# Altium schematic sheet QUTMS-TSAL-S00.SchDoc: Tractive System Active Light - TSAL
size A3; DrawnBy: Joseph Richards; DocumentNumber: 1; Revision: 1; SheetNumber: 1; SheetTotal: 5
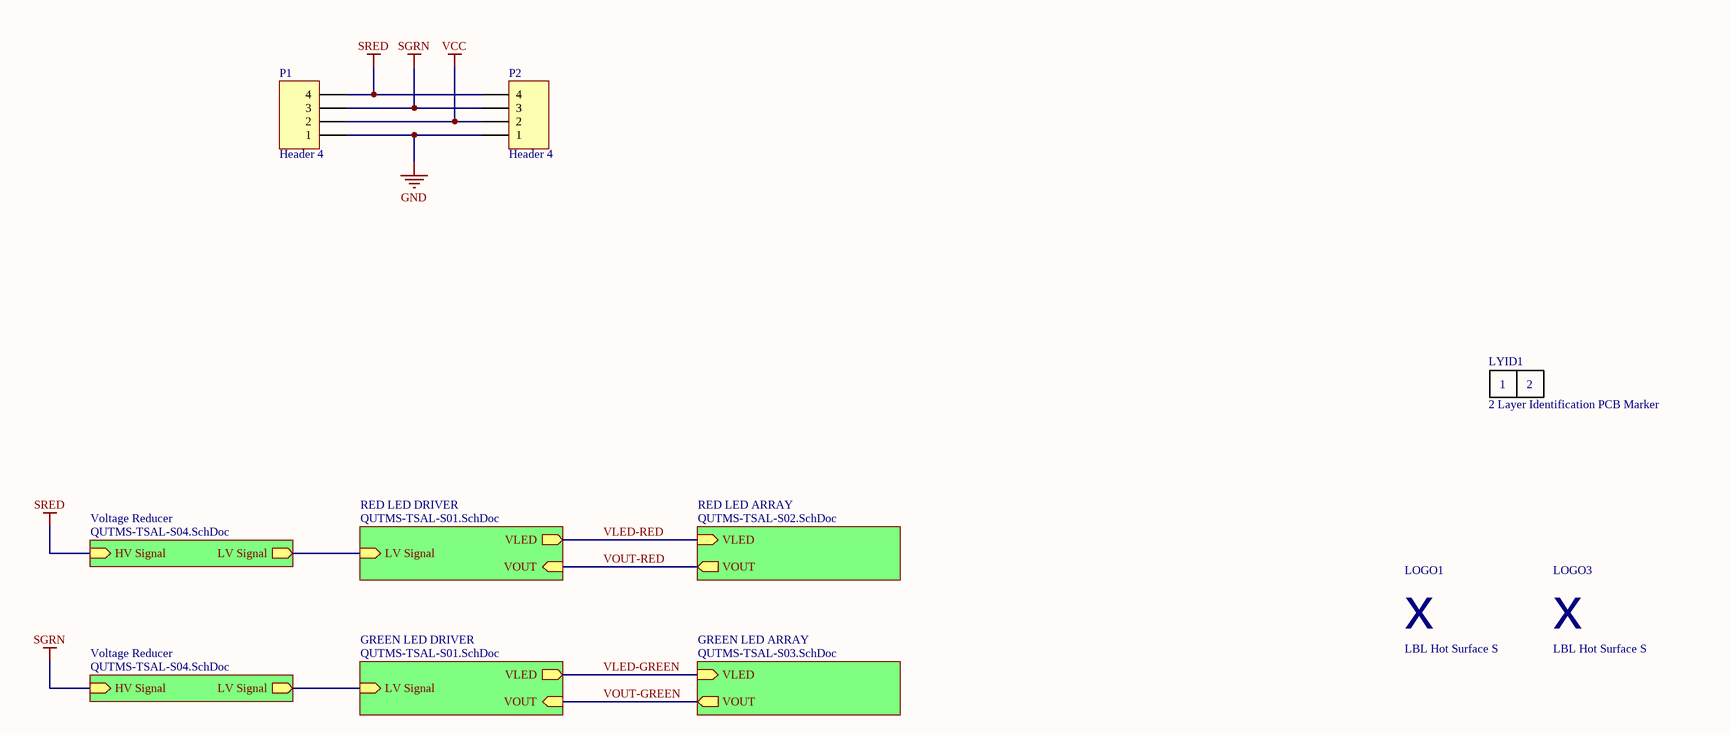
[diagram p0: QUTMS-TSAL-S00.SchDoc]

## Parts
LOGO1  LBL Hot Surface S  [LBL HOT SMALL]
LOGO3  LBL Hot Surface S  [LBL HOT SMALL]
LYID1  2 Layer Identification PCB Marker  [LAYER IDENT 2]
P1  Header 4  [HDR1X4]
P2  Header 4  [HDR1X4]

## Sub-sheets
GREEN LED ARRAY = QUTMS-TSAL-S03.SchDoc: VOUT (out), VLED (in)
GREEN LED DRIVER = QUTMS-TSAL-S01.SchDoc: VLED (out), VOUT (in), LV Signal (in)
RED LED ARRAY = QUTMS-TSAL-S02.SchDoc: VOUT (out), VLED (in)
RED LED DRIVER = QUTMS-TSAL-S01.SchDoc: VLED (out), VOUT (in), LV Signal (in)
Voltage Reducer = QUTMS-TSAL-S04.SchDoc: HV Signal (in), LV Signal (out)
Voltage Reducer = QUTMS-TSAL-S04.SchDoc: HV Signal (in), LV Signal (out)

## Nets
GND: P1.1 P2.1
SGRN: P1.3 P2.3 ; sheet Voltage Reducer/HV Signal
SRED: P1.4 P2.4 ; sheet Voltage Reducer/HV Signal
VCC: P1.2 P2.2
VLED-GREEN: sheet GREEN LED ARRAY/VLED, sheet GREEN LED DRIVER/VLED
VLED-RED: sheet RED LED DRIVER/VLED, sheet RED LED ARRAY/VLED
VOUT-GREEN: sheet GREEN LED ARRAY/VOUT, sheet GREEN LED DRIVER/VOUT
VOUT-RED: sheet RED LED DRIVER/VOUT, sheet RED LED ARRAY/VOUT
(unnamed): sheet RED LED DRIVER/LV Signal, sheet Voltage Reducer/LV Signal
(unnamed): sheet GREEN LED DRIVER/LV Signal, sheet Voltage Reducer/LV Signal

## Notes on the sheet
- Revision History:
- Sheet Title:
- Rev
- Date
- Description
- Project:
- Size:
- Drawn By:
- A3
- Number:
- Revision:
- Sheet
- Version:
- of
- QUT Motorsport
- O-120, Gardens Point
- 2 George Street
- Brisbane, QLD 4000
- Australia
- Print Date:
- Print Time:
- File Name:
- (in symbol Layer Identification 2) 1; 2
- (in symbol LBL Hot Surface S) x

## Library data of the parts
LYID1 = Layer Identification 2
P1 P2 = Header 4: Header, 4-Pin; LatestRevisionDate: 17-Jul-2002; LatestRevisionNote: Re-released for DXP Platform.; Publisher: Altium Limited